# EAGLE design USB PROGRAMMER (EAGLE 8.3.1)
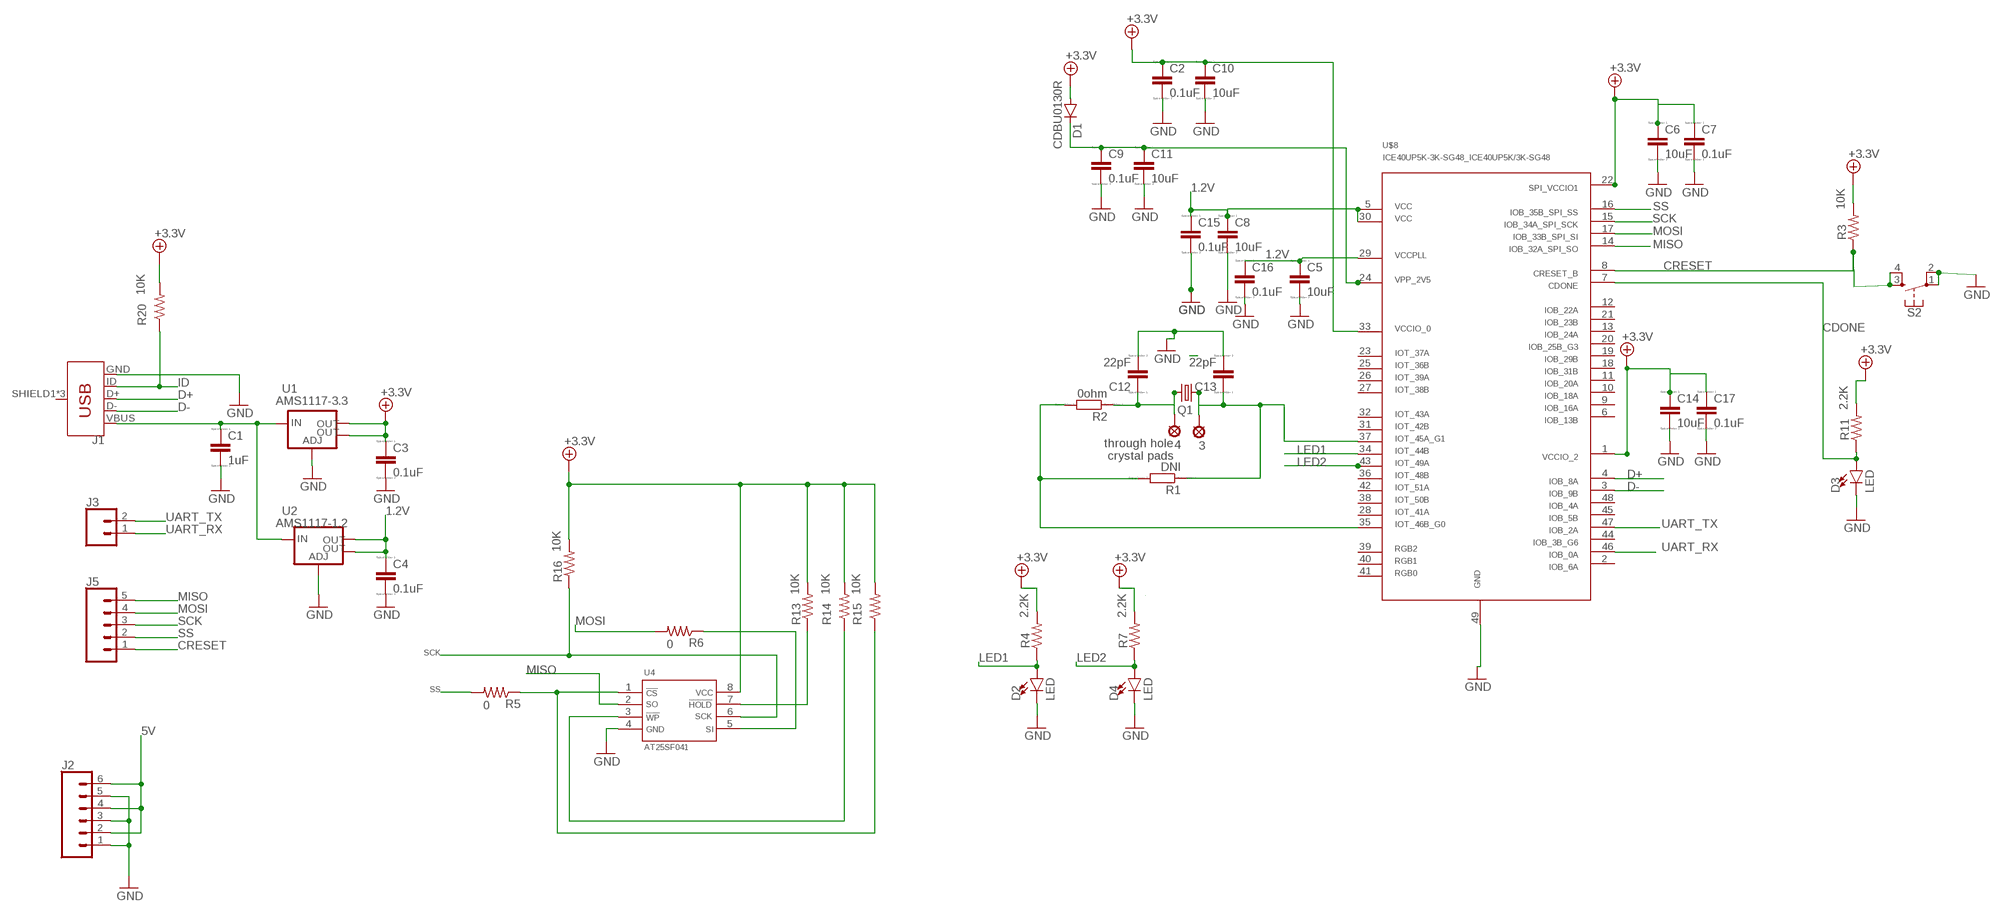
[diagram p0: schematic, sheet 1]

## Parts
3  LSP10  [LSP10]
4  LSP10  [LSP10]
C1  1uF  CC0402  [C0402]
C2  0.1uF  CC0402  [C0402]
C3  0.1uF  CC0402  [C0402]
C4  0.1uF  CC0402  [C0402]
C5  10uF  CC0402  [C0402]
C6  10uF  CC0402  [C0402]
C7  0.1uF  CC0402  [C0402]
C8  10uF  CC0402  [C0402]
C9  0.1uF  CC0402  [C0402]
C10  10uF  CC0402  [C0402]
C11  10uF  CC0402  [C0402]
C12  22pF  CC0402  [C0402]
C13  22pF  CC0402  [C0402]
C14  10uF  CC0402  [C0402]
C15  0.1uF  CC0402  [C0402]
C16  0.1uF  CC0402  [C0402]
C17  0.1uF  CC0402  [C0402]
D1  CDBU0130R  DIODE1  [SOD523]
D2  LED  LED0603  [LED-0603]
D3  LED  LED0603  [LED-0603]
D4  LED  LED0603  [LED-0603]
J1  USB_MICRO-B_FEMALE-SMT  [USB-B-MICRO-SMD]
J2  CONN_06NO_SILK_FEMALE_PTH  [1X06_NO_SILK]
J3  CONN_02  [1X02]
J5  CONN_05  [1X05]
Q1  CRYSTALHC49UP  [HC49UP]
R1  DNI  RR0402  [R0402]
R2  0ohm  RR0402  [R0402]
R3  10K  RESISTOR0603  [0603-RES]
R4  2.2K  RESISTOR0603  [0603-RES]
R5  0  RESISTOR0805-RES  [0805]
R6  0  RESISTOR0805-RES  [0805]
R7  2.2K  RESISTOR0603  [0603-RES]
R11  2.2K  RESISTOR0603  [0603-RES]
R13  10K  RESISTOR0603-RES  [0603-RES]
R14  10K  RESISTOR0603-RES  [0603-RES]
R15  10K  RESISTOR0603-RES  [0603-RES]
R16  10K  RESISTOR0603-RES  [0603-RES]
R20  10K  RESISTOR0603  [0603-RES]
S2  MOMENTARY-SWITCH-SPST-2-SMD-4.6X2.8MM  [TACTILE_SWITCH_SMD_4.6X2.8MM]
U1  AMS1117-3.3  V_REG_LM1117SOT223  [SOT223]
U2  AMS1117-1.2  V_REG_LM1117SOT223  [SOT223]
U4  AT25SF041  [SO8]
U$8  ICE40UP5K-3K-SG48_ICE40UP5K/3K-SG48  [ICE40UP5K-3K-SG48_ICE40UP5K/3K-SG48]

## Nets
1.2V: C4.1 C5.1 C8.1 C15.1 C16.1 U2.2(OUT) U2.4(OUT) U$8.5 U$8.29 U$8.30
2: R1.2 R2.2 U$8.35
5V: C1.1 J1.VBUS J2.2 J2.4 J2.6 U1.3(IN) U2.3(IN)
+3.3V: C2.1 C3.1 C6.1 C7.1 C10.1 C14.1 C17.1 D1.A R3.2 R4.2 R7.2 R11.2 R13.2 R14.2 R15.2 R16.2 R20.2 U1.2(OUT) U1.4(OUT) U4.8 U$8.1 U$8.22 U$8.33
CDONE: D3.A R11.1 U$8.7
CRESET: J5.1 R3.1 S2.3 S2.4 U$8.8
D+: J1.D+ U$8.4
D-: J1.D- U$8.3
GND: C1.2 C2.2 C3.2 C4.2 C5.2 C6.2 C7.2 C8.2 C9.2 C10.2 C11.2 C12.2 C13.2 C14.2 C15.2 C16.2 C17.2 D2.C D3.C D4.C J1.GND J2.1 J2.3 J2.5 S2.1 S2.2 U1.1(ADJ) U2.1(ADJ) U4.4 U$8.49
ID: J1.ID R20.1
LED1: D2.A R4.1 U$8.34
LED2: D4.A R7.1 U$8.43
MISO: J5.5 U4.2 U$8.14
MOSI: J5.4 R6.2 U$8.17
N$1: 4.MP C12.1 Q1.2 R2.1
N$4: R13.1 U4.7
N$5: 3.MP C13.1 Q1.1 R1.1 U$8.37
N$6: R14.1 U4.3
N$7: R5.1 R15.1 U4.1
N$10: C9.1 C11.1 D1.C U$8.24
N$13: R6.1 U4.5
N$15: U$8.39
N$16: U$8.40
SCK: J5.3 R16.1 U4.6 U$8.15
SS: J5.2 R5.2 U$8.16
UART_RX: J3.1 U$8.46
UART_TX: J3.2 U$8.47
Unconnected: J1.SHIELD1(SHIELD) J1.SHIELD2(SHIELD) J1.SHIELD3(SHIELD) U$8.2 U$8.6 U$8.9 U$8.10 U$8.11 U$8.12 U$8.13 U$8.18 U$8.19 U$8.20 U$8.21 U$8.23 U$8.25 U$8.26 U$8.27 U$8.28 U$8.31 U$8.32 U$8.36 U$8.38 U$8.41 U$8.42 U$8.44 U$8.45 U$8.48

## Notes on the sheet
- through hole
   crystal pads

## Library data of the parts
3 4 = solpad:LSP10: SOLDER PAD drill 1.0 mm, distributor Buerklin, 12H555
C1-C17 = eagle-ltspice:C: CAPACITOR, European symbol; SPICEMODEL: NONE; SPICEPREFIX: C
D1 = CDBU0130R:DIODE1
D2-D4 = SparkFun-LED:LED: LED (Generic) Standard schematic elements and footprints for 5mm, 3mm, 1206, and 0603 sized LEDs. Generic LEDs with no color specified.
J1 = MICRO USB 105164-0001:USB_MICRO-B: USB Type Micro-B Connector Male/female and PTH/SMT variants SparkFun Products: SparkFun microB USB Breakout <https://www.sparkfun.com/products/12035> SparkFun USB microB Plug Breakout <https://www.sparkfun.com/products/10031> SparkFun ESP8266 Thing <https://www.sparkfun.com/products/13231>; PROD_ID: CONN-11752
J2 = SparkFun-Connectors:CONN_06: Multi connection point. Often used as Generic Header-pin footprint for 0.1 inch spaced/style header connections On any of the 0.1 inch spaced packages, you can populate with these: Break Away Headers - Straight <https://www.sparkfun.com/products/116> (PRT-00116) Break Away Male Headers - Right Angle <https://www.sparkfun.com/products/553> (PRT-00553) Female Headers <https://www.sparkfun.com/products/115> (PRT-00115) Break Away Headers - Machine Pin <https://www.sparkfun.com/products/117> (PRT-00117) Break Away Female Headers - Swiss Machine Pin <https://www.sparkfun.com/products/743> (PRT-00743) Arduino Stackable Header - 6 Pin <https://www.sparkfun.com/products/9280> (PRT-09280) For SCREWTERMINALS and SPRING TERMINALS visit here: Screw Terimnals on SparkFun.com <https://www.sparkfun.com/search/results?term=Screw+Terminals> (5mm/3.5mm/2.54mm spacing) This device is also useful as a general connection point to wire up your design to another part of your project. Our various solder wires solder well into these plated through hole pads. Hook-Up Wire - Assortment (Stranded, 22 AWG) <https://www.sparkfun.com/products/11375> (PRT-11375) Hook-Up Wire - Assortment (Solid Core, 22 AWG) <https://www.sparkfun.com/products/11367> (PRT-11367) View the entire wire category on our website here <https://www.sparkfun.com/categories/141>; PROD_ID: CONN-08437
J3 = SparkFun-Connectors:CONN_02: Multi connection point. Often used as Generic Header-pin footprint for 0.1 inch spaced/style header connections On any of the 0.1 inch spaced packages, you can populate with these: Break Away Headers - Straight <https://www.sparkfun.com/products/116> (PRT-00116) Break Away Male Headers - Right Angle <https://www.sparkfun.com/products/553> (PRT-00553) Female Headers <https://www.sparkfun.com/products/115> (PRT-00115) Break Away Headers - Machine Pin <https://www.sparkfun.com/products/117> (PRT-00117) Break Away Female Headers - Swiss Machine Pin <https://www.sparkfun.com/products/743> (PRT-00743) For SCREWTERMINALS and SPRING TERMINALS visit here: Screw Terimnals on SparkFun.com <https://www.sparkfun.com/search/results?term=Screw+Terminals> (5mm/3.5mm/2.54mm spacing) This device is also useful as a general connection point to wire up your design to another part of your project. Our various solder wires solder well into these plated through hole pads. Hook-Up Wire - Assortment (Stranded, 22 AWG) <https://www.sparkfun.com/products/11375> (PRT-11375) Hook-Up Wire - Assortment (Solid Core, 22 AWG) <https://www.sparkfun.com/products/11367> (PRT-11367) View the entire wire category on our website here <https://www.sparkfun.com/categories/141> Special notes: Molex polarized connector foot print use with: PRT-08233 with associated crimp pins and housings. 2.54_SCREWTERM for use with PRT-10571. 3.5mm Screw Terminal footprints for PRT-08084 5mm Screw Terminal footprints for use with PRT-08432
J5 = SparkFun-Connectors:CONN_05: Multi connection point. Often used as Generic Header-pin footprint for 0.1 inch spaced/style header connections On any of the 0.1 inch spaced packages, you can populate with these: Break Away Headers - Straight <https://www.sparkfun.com/products/116> (PRT-00116) Break Away Male Headers - Right Angle <https://www.sparkfun.com/products/553> (PRT-00553) Female Headers <https://www.sparkfun.com/products/115> (PRT-00115) Break Away Headers - Machine Pin <https://www.sparkfun.com/products/117> (PRT-00117) Break Away Female Headers - Swiss Machine Pin <https://www.sparkfun.com/products/743> (PRT-00743) For SCREWTERMINALS and SPRING TERMINALS visit here: Screw Terimnals on SparkFun.com <https://www.sparkfun.com/search/results?term=Screw+Terminals> (5mm/3.5mm/2.54mm spacing) This device is also useful as a general connection point to wire up your design to another part of your project. Our various solder wires solder well into these plated through hole pads. Hook-Up Wire - Assortment (Stranded, 22 AWG) <https://www.sparkfun.com/products/11375> (PRT-11375) Hook-Up Wire - Assortment (Solid Core, 22 AWG) <https://www.sparkfun.com/products/11367> (PRT-11367) View the entire wire category on our website here <https://www.sparkfun.com/categories/141> Special notes: Molex polarized connector foot print use with SKU : PRT-08231 with associated crimp pins and housings. 1MM SMD Version SKU: PRT-10208
Q1 = crystal:CRYSTAL: CRYSTAL; OC_FARNELL: unknown; OC_NEWARK: unknown
R1 R2 = eagle-ltspice:R: RESISTOR, European symbol; SPICEMODEL: NONE; SPICEPREFIX: R
R3-R7 R11 R13-R16 R20 = SparkFun-Resistors:RESISTOR: Resistor Basic schematic elements and footprints for 0603, 1206, and PTH resistors.
S2 = SparkFun-Switches:MOMENTARY-SWITCH-SPST-2: Momentary Switch (Pushbutton) - SPST - Two Circuits Normally-open (NO) SPST momentary switches (buttons, pushbuttons). Schematic symbol includes two switch circuits. Variants SMD-4.6MMX2.8MM - 4.60mm x 2.80mm Tactile Momentary Button Switch - Used on SparkFun SAMD21 Mini Breakout <https://www.sparkfun.com/products/13664> SMD-5.2MM - Mini Pushbutton Switch - SMD <https://www.sparkfun.com/products/8720> - Used on Arduino Pro Mini <https://www.sparkfun.com/products/11114>; PROD_ID: SWCH-13065
U1 U2 = SparkFun-IC-Power:V_REG_LM1117: Voltage Regulator LM1117 Standard adjustable voltage regulator but in SMD form. Spark Fun Electronics SKU : COM-00595; PROD_ID: VREG-08170
U4 = AT25SF041:AT25SF041
U$8 = ICE40UP5K-3K-SG48:ICE40UP5K-3K-SG48_ICE40UP5K/3K-SG48

## Net classes
0 default: width 0.1 mm, drill 0.305 mm

## Board
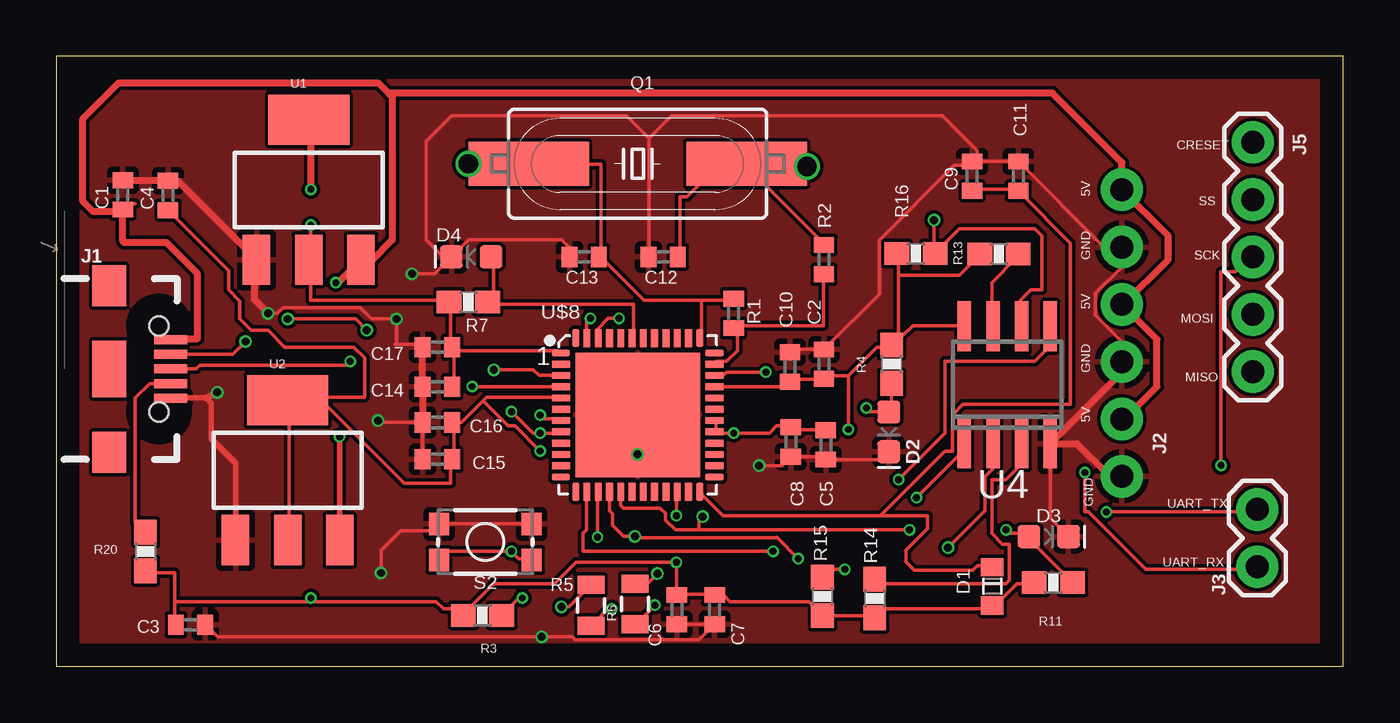
[diagram p1: board, top side]
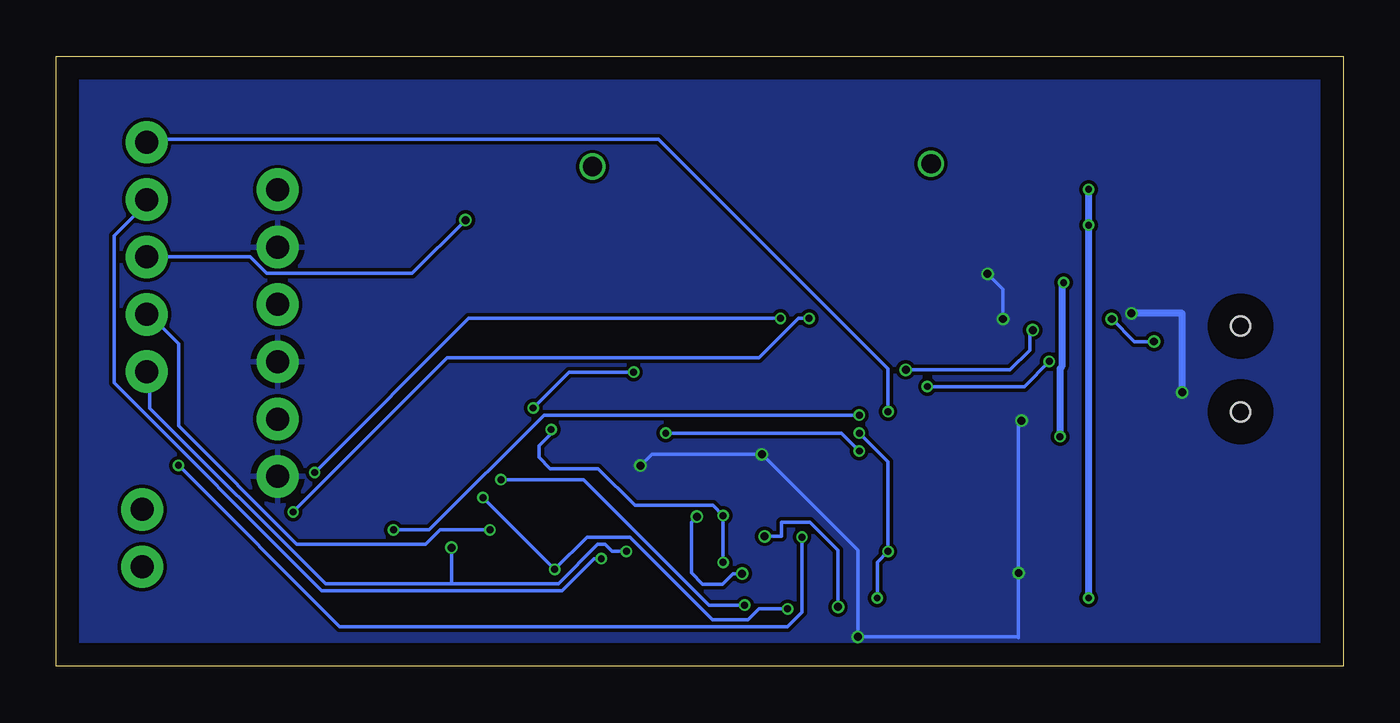
[diagram p2: board, bottom side, seen from below]

Size 57 x 27 mm. Coordinates in mm from the lower left corner, seen from the top.
Outline: 0,0 57,0 57,27 0,27 0,0
Copper layers (1*16): Top 0.035mm / dielectric 1.5mm / Bottom 0.035mm
Design rules "default *": minimum track width 6mil, minimum drill 0.3mm, track to track 6mil, track to pad 6mil, pad to pad 6mil, via to via 6mil, smd to smd 0mil, copper to edge 40mil, drill to drill 8mil, minimum pad ring 5mil, minimum via ring 4mil, stop-mask expansion 4mil, vias tented up to drill 0mil, thermal gap 10mil

### Footprints (pad centres in the part's own frame; a part is rotated, then mirrored left to right if it is on the bottom)
LSP10 = drill 0.85: MP 0,0
C0402 = smd 0.7 x 0.9: 1 -0.65,0; 2 0.65,0
SOD523 = smd 0.8 x 1: A 1.1,0; C -0.6,0
LED-0603 = smd 1 x 1: A -0.877,0; C 0.877,0
USB-B-MICRO-SMD = smd 1.45 x 0.4: D+ 2.725,0; D- 2.725,0.65; GND 2.725,-1.3; ID 2.725,-0.65; VBUS 2.725,1.3 | smd 1.5 x 1.8: SHIELD1 0,3.685; SHIELD2 0,-3.685 | smd 1.5 x 2.5: SHIELD3 0,0 | hole 0.85: 2.2,1.9; 2.2,-1.9
1X06_NO_SILK = drill 1.016 pad 1.88: 1 0,0; 2 2.54,0; 3 5.08,0; 4 7.62,0; 5 10.16,0; 6 12.7,0
1X02 = drill 1.016 pad 1.88: 1 0,0; 2 2.54,0
1X05 = drill 1.016 pad 1.88: 1 0,0; 2 2.54,0; 3 5.08,0; 4 7.62,0; 5 10.16,0
HC49UP = smd 5.334 x 1.93: 1 -4.826,0; 2 4.826,0
R0402 = smd 0.7 x 0.9: 1 -0.65,0; 2 0.65,0
0603-RES = smd 1.1 x 1: 1 -0.85,0; 2 0.85,0
0805 = smd 0.8 x 1.2: 1 -0.9,0; 2 0.9,0
TACTILE_SWITCH_SMD_4.6X2.8MM = smd 0.9 x 1: 1 -2.05,-0.8; 2 2.05,-0.8; 3 2.05,0.8; 4 -2.05,0.8
SOT223 = smd 1.219 x 2.235: 1 -2.311,-3.099; 2 0,-3.099; 3 2.311,-3.099 | smd 3.6 x 2.2: 4 0,3.099
SO8 = smd 0.6 x 2.2: 1 -1.905,-2.6; 2 -0.635,-2.6; 3 0.635,-2.6; 4 1.905,-2.6; 5 1.905,2.6; 6 0.635,2.6; 7 -0.635,2.6; 8 -1.905,2.6
ICE40UP5K-3K-SG48_ICE40UP5K/3K-SG48 = smd 0.8 x 0.3: 1 -3.4,2.75; 2 -3.4,2.25; 3 -3.4,1.75; 4 -3.4,1.25; 5 -3.4,0.75; 6 -3.4,0.25; 7 -3.4,-0.25; 8 -3.4,-0.75; 9 -3.4,-1.25; 10 -3.4,-1.75; 11 -3.4,-2.25; 12 -3.4,-2.75; 25 3.4,-2.75; 26 3.4,-2.25; 27 3.4,-1.75; 28 3.4,-1.25; 29 3.4,-0.75; 30 3.4,-0.25; 31 3.4,0.25; 32 3.4,0.75; 33 3.4,1.25; 34 3.4,1.75; 35 3.4,2.25; 36 3.4,2.75 | smd 0.3 x 0.8: 13 -2.75,-3.4; 14 -2.25,-3.4; 15 -1.75,-3.4; 16 -1.25,-3.4; 17 -0.75,-3.4; 18 -0.25,-3.4; 19 0.25,-3.4; 20 0.75,-3.4; 21 1.25,-3.4; 22 1.75,-3.4; 23 2.25,-3.4; 24 2.75,-3.4; 37 2.75,3.4; 38 2.25,3.4; 39 1.75,3.4; 40 1.25,3.4; 41 0.75,3.4; 42 0.25,3.4; 43 -0.25,3.4; 44 -0.75,3.4; 45 -1.25,3.4; 46 -1.75,3.4; 47 -2.25,3.4; 48 -2.75,3.4 | smd 5.5 x 5.5: 49 0,0

### Placement (x,y rotation side)
3  18.25,22.25 0 top
4  33.25,22.12 0 top
C1  2.94,20.87 90 top
C2  34,13.38 90 top
C3  5.95,1.83 0 top
C4  4.95,20.84 90 top
C5  34.09,9.8 270 top
C6  27.48,2.5 270 top
C7  29.16,2.5 270 top
C8  32.53,9.93 270 top
C9  40.56,21.7 90 top
C10  32.5,13.25 90 top
C11  42.62,21.7 90 top
C12  26.88,18.12 180 top
C13  23.38,18.12 180 top
C14  16.88,12.38 180 top
C15  16.88,9.16 180 top
C16  16.88,10.79 180 top
C17  16.88,14.12 180 top
D1  41.46,3.79 270 top
D2  36.88,10.38 270 top
D3  43.96,5.74 0 top
D4  18.38,18.12 180 top
J1  2.34,13.16 0 top
J2  47.2,8.4 90 top
J3  53.2,4.4 90 top
J5  53,23.2 270 top
Q1  25.75,22.25 0 top
R1  30,15.62 270 top
R2  34,18 270 top
R3  18.88,2.25 180 top
R4  37,13.38 90 top
R5  23.68,2.69 90 top
R6  25.62,2.75 90 top
R7  18.25,16.12 180 top
R11  44.16,3.71 180 top
R13  41.76,18.25 180 top
R14  36.25,3 270 top
R15  33.94,3.09 270 top
R16  38.08,18.27 180 top
R20  3.95,5.08 270 top
S2  19,5.5 180 top
U1  11.18,21.09 0 top
U2  10.24,8.68 0 top
U4  42.12,12.46 0 top
U$8  25.75,11.12 0 top

### Tracks (layer width: path | path; a pad name or v marks a point on that pad's centre or on a via)
1.2V  (via drill 0.3)
  Top 0.152: U$8.30 29.21,10.79 29.21,10.48 U$8.29 29.21,10.32 v30,10.32 31.59,10.32 31.91,10.64 32.38,10.64 C8.1 32.54,10.48 33.97,10.48 C5.1 | 18.89,11.75 17.94,10.79 17.62,10.79 C16.1 17.62,10.64 17.62,9.21 C15.1 17.46,9.05 17.46,8.1 15.4,8.1 11.59,11.91 | 18.89,11.75 19.05,11.91 22.23,11.91 U$8.5 | v21.43,9.53 20.32,10.64 20,10.64 18.89,11.75 | 11.59,11.91 10.32,11.91 U2.4 | 11.59,11.91 13.65,11.91 13.65,13.65 13.18,14.13 10.12,14.13 9.38,14.88 8.62,14.88 8.12,15.38 8.12,16.16 7.62,16.67 7.62,17.52 C4.1 5.08,20.16 | U2.2 10.32,5.71 10.32,11.75 U2.4 | 11.59,11.91 U2.4
  Bottom 0.152: v30,10.32 22.23,10.32 v21.43,9.53
2
  Top 0.152: U$8.35 29.21,13.49 29.69,13.49 30.16,13.97 30.16,14.92 30,14.92 R1.2 30,15.08 33.97,15.08 33.97,17.3 R2.2
5V  (via drill 0.3)
  Top 0.152: 3.49,20.48 3.17,20.48 3.02,20.32 C1.1 | v12.38,16.99 13.34,17.94 U1.3
  Top 0.254: U2.3 12.54,5.59 v12.54,10.16
  Top 0.305: J1.VBUS 5.11,14.5 6.25,14.5 6.25,17.38 4.88,18.75 3,18.75 2.94,18.81 C1.1 2.85,20.12 1.62,20.12 1.17,20.58 1.17,24.25 2.75,25.83 14.25,25.83 14.76,25.32 | 14.76,25.32 14.88,25.21 14.88,18.88 13.94,17.94 13.34,17.94 | U1.3 12.48,16.99 v12.38,16.99 | 14.76,25.32 14.81,25.38 44.12,25.38 47.2,22.3 J2.6 49.25,19.05 49.25,18 47.27,16.02 J2.4 48.75,14.47 48.75,12.38 47.31,10.94 J2.2
  Bottom 0.305: v12.54,10.16 12.54,13.18 12.46,13.26 12.46,16.91 v12.38,16.99
+3.3V  (via drill 0.3)
  Top 0.152: 17.62,13.97 22.23,13.97 U$8.1 | 17.62,13.97 17.62,12.38 C14.1 | 17.62,13.97 C17.1 17.46,14.13 17.46,16.03 R7.2 17.3,16.19 11.27,16.19 11.27,17.94 U1.2 11.27,18.1 v11.27,19.53 | U$8.33 29.21,12.38 32.23,12.38 32.38,12.54 C10.1 32.54,12.7 33.97,12.7 C2.1 34.13,12.86 35.08,12.86 | 37.47,14.61 37.94,15.08 40.16,15.08 U4.8 | 37.47,14.61 37.15,14.29 R4.2 | 37.31,17.3 37.31,14.61 37.47,14.61 | 37.31,17.3 37.31,18.26 R16.2 | 37.47,14.61 R4.2 | 37.31,17.3 40.01,17.3 40.8,18.1 R13.2 | 35.08,12.86 36.35,14.13 36.99,14.13 R4.2 | R11.2 43.18,3.65 42.55,3.65 41.59,2.7 D1.A 41.43,2.54 36.67,2.54 36.35,2.22 R14.2 36.2,2.22 33.97,2.22 R15.2 33.81,2.38 33.34,2.86 29.84,2.86 29.53,3.17 29.21,3.17 C7.1 29.05,3.17 27.62,3.17 C6.1 27.46,3.17 v27.46,4.59 26.83,4.6 23.02,4.6 22.07,3.65 19.37,3.65 18.26,2.54 | 5.24,2.86 5.24,4.13 3.97,4.13 R20.2 | 5.24,2.86 5.24,1.91 C3.1 | v27.46,6.67 27.46,7.62 U$8.22 | 18.26,2.54 18.1,2.38 R3.2 18.26,2.54 | 11.27,2.86 16.83,2.86 17.14,2.54 18.26,2.54 | 11.27,2.86 5.24,2.86 | v35.08,10.48 35.08,12.86 | 11.27,2.86 v11.27,3.02
  Top 0.305: U1.4 11.27,24.1 v11.27,21.11
  Bottom 0.152: v27.46,4.59 v27.46,6.67 27.92,7.12 31.38,7.12 33,8.75 35.12,8.75 35.62,9.25 35.62,9.75 35.08,10.29 v35.08,10.48 | v11.27,19.52 v11.27,19.53
  Bottom 0.305: v11.27,3.02 v11.27,19.52 | v11.27,19.53 v11.27,21.11
CDONE  (via drill 0.3)
  Top 0.152: v21.43,11.11 21.59,10.95 22.23,10.95 U$8.7 | v42.07,6.03 42.23,5.87 43.02,5.87 D3.A 43.02,5.71 44.93,3.81 R11.1
  Bottom 0.152: v21.43,11.11 35.4,11.11 40.48,6.03 v42.07,6.03
CRESET  (via drill 0.3)
  Top 0.152: U$8.8 22.23,10.32 v21.43,10.32 21.11,10.32 v20.16,11.27 | S2.4 20.95,4.76 20.48,4.76 v20.16,5.08 17.3,5.08 16.99,4.76 S2.3 | v20.64,3.02 20.48,3.02 19.84,2.38 R3.1
  Bottom 0.152: v21.43,10.32 20.16,9.05 v20.16,5.08 20.64,4.6 v20.64,3.02 | v20.16,11.27 20.16,13.18 30.32,23.34 52.86,23.34 J5.1
D+  (via drill 0.3)
  Top 0.152: v18.41,12.38 22.23,12.38 U$8.4 | v13.02,13.49 12.86,13.34 6.35,13.34 6.19,13.18 5.08,13.18 J1.D+
  Bottom 0.152: v13.02,13.49 14.13,12.38 v18.41,12.38
D-  (via drill 0.35)
  Top 0.152: U$8.3 21.38,12.88 21.12,13.12 v19.38,13.12 | v13.75,14.88 13.25,15.38 v10.25,15.38 | J1.D- 7.81,13.81 v8.38,14.38
  Bottom 0.152: v19.38,13.12 14.75,13.12 13.88,14 13.88,14.88 v13.75,14.88 | v10.25,15.38 9.25,14.38 v8.38,14.38
GND  (via drill 0.35)
  Top 0.152: S2.1 S2.2 16.65,6 15.25,6 14.38,5.12 v14.38,4.12 | C6.2 C7.2 28.48,1.17 22.98,1.17 22.85,1.29 v21.5,1.29 7.13,1.29 C3.2 | 47.2,13.33 J2.3 47.2,14.37 46.03,15.54 46.03,16.5 47.2,17.67 J2.5 46.41,18.56 C11.2 40.78,22.35 | D3.C 44.03,6.54 U4.4 | D2.C 36.53,9.15 C5.2 33.96,9.28 C8.2 32.13,8.88 v31.12,8.88 | C10.2 32.62,14.03 C2.2 36.45,16.48 36.45,18.87 39.76,22.17 40.39,22.17 C9.2 40.78,22.35 | v25.75,9.38 U$8.49 | 7.93,6.07 U2.1 | C15.2 16.23,11.09 | v9.38,15.63 9.79,15.63 10.04,15.88 13.46,15.88 13.96,15.38 v15.06,15.38 15.06,14.31 15,14.25 16.1,14.25 C17.2 | v14.25,10.88 14.25,10.75 14.29,10.79 C16.2 16.23,12.21 C14.2 16.23,12.4 | 17.54,18.16 D4.C 16.75,17.38 v15.75,17.38 | 17.54,18.16 18.25,18.88 22.38,18.88 22.73,18.52 C13.2 | C12.2 26.25,18.15 26.25,23.38 | 26.25,23.38 27.25,24.38 39.25,24.38 40.78,22.85 40.78,22.35 | 26.25,23.38 25.25,24.38 17.5,24.38 16.38,23.25 16.38,18.88 17.09,18.16 17.54,18.16
  Top 0.254: J1.GND 5.08,11.88 6.62,11.88 6.86,11.64 6.86,10.07 7.93,8.99 7.93,6.07
  Top 0.305: 16.23,11.09 16.23,12.21 16.23,12.4 C17.2 | C1.2 2.96,21.5 4.85,21.5 C4.2 5.37,21.5 8.78,18.09 | 8.78,18.09 U1.1 | 6.62,11.88 v7.12,12.12 | v9.38,15.63 8.78,16.23 8.78,18.09 | J2.1 46.67,8.4 45.21,9.86 U4.4 47.2,13.03 47.2,13.33
  Bottom 0.152: v31.12,8.88 30.62,9.38 v25.75,9.38 21.5,5.12 v21.5,1.29 14.42,1.29 arc90 14.38,1.25 14.38,3.95 v14.38,4.12 14.38,10.75 v14.25,10.88 | v15.75,17.38 15.06,16.69 v15.06,15.38
  Bottom 0.305: v7.12,12.12 7.12,15.62 v9.38,15.62 v9.38,15.63
  pour Top (isolate 0.12): 0,27 57,27 57,0 0,0
  pour Bottom (isolate 0.12): 0,27 57,27 57,0 0,0
ID
  Top 0.152: J1.ID 4.12,12.5 3.5,11.88 3.5,6.38 arc90 R20.1
LED1  (via drill 0.3)
  Top 0.152: v31.43,13.02 29.69,13.02 29.53,12.86 29.21,12.86 U$8.34 | v35.88,11.43 36.04,11.27 36.83,11.27 D2.A 36.99,11.27 36.99,12.38 R4.1
  Bottom 0.152: v31.43,13.02 34.29,13.02 v35.88,11.43
LED2
  Top 0.152: U$8.43 25.56,14.61 25.56,16.03 19.21,16.03 R7.1 19.21,16.19 19.37,16.19 19.37,18.1 D4.A
MISO  (via drill 0.3, 0.35)
  Top 0.152: v31.75,5.08 23.34,5.08 23.34,5.87 23.5,6.03 23.5,7.62 U$8.14 | v39.5,5.25 41.13,6.88 41.13,8.38 41.49,8.74 U4.2
  Bottom 0.152: v31.75,5.08 32.38,5.08 32.7,5.4 33.02,5.4 34.77,3.65 39.51,3.65 | 39.51,3.65 45.09,3.65 52.86,11.43 52.86,13.02 J5.5 | v39.5,5.25 39.5,3.66 39.51,3.65
MOSI  (via drill 0.3, 0.35)
  Top 0.152: 25.08,7.62 U$8.17 25,7.12 25.12,7 26.75,7 26.98,6.77 26.98,6.47 27.42,6.03 28.47,6.03 | 28.47,6.03 v37.79,6.03 | R6.2 26.18,3.65 v26.62,4.1 | v28.62,6.62 28.47,6.46 28.47,6.03
  Bottom 0.152: v37.79,6.03 40.01,6.03 40.64,5.4 46.35,5.4 51.59,10.64 51.59,14.29 52.86,15.56 J5.4 | v26.62,4.1 27.03,4.1 27.5,3.62 28.38,3.62 28.88,4.12 28.88,6.38 v28.62,6.62
N$1
  Top 0.152: 30.48,22.23 29.37,22.23 27.94,20.8 27.62,20.8 27.62,18.26 C12.1 | 30.48,22.23 33.97,18.73 R2.1 | 30.48,22.23 Q1.2 30.64,22.23 4.MP
N$4
  Top 0.152: R13.1 42.55,18.1 41.43,16.99 41.43,15.08 U4.7
N$5
  Top 0.152: 28.57,16.19 28.57,14.61 U$8.37 | 28.57,16.19 29.84,16.19 R1.1 | 28.57,16.19 26.04,16.19 24.13,18.1 C13.1 24.13,18.26 24.13,22.23 21.11,22.23 3.MP 20.95,22.23 Q1.1
N$6
  Top 0.152: R14.1 36.35,3.81 36.51,3.65 42.07,3.65 42.23,3.81 42.23,5.4 41.91,5.4 41.43,5.87 41.43,8.26 42.07,8.26 42.7,8.89 42.7,9.84 U4.3
N$7  (via drill 0.3)
  Top 0.152: v34.92,4.29 34.29,4.29 33.97,3.97 R15.1 | v38.1,7.46 40.16,9.53 40.16,9.84 U4.1 | v24.61,2.54 24.45,2.54 23.81,1.91 R5.1
  Bottom 0.152: v38.1,7.46 v34.92,4.29 33.5,5.71 31.59,5.71 27.94,2.06 26.35,2.06 25.88,2.54 v24.61,2.54
N$10
  Top 0.152: C9.1 40.64,21.11 42.55,21.11 C11.1 42.7,20.95 44.93,18.73 44.93,11.59 40.16,11.59 39.69,11.11 39.69,9.53 39.37,9.53 36.51,6.67 | 36.51,6.67 38.58,6.67 38.58,6.08 37.62,5.12 37.62,4.62 38,4.25 40.6,4.25 40.8,4.45 41.43,4.45 D1.C | 36.51,6.67 29.53,6.67 28.57,7.62 U$8.24
N$13  (via drill 0.3)
  Top 0.152: v26.51,2.7 25.72,1.91 R6.1 | v37.31,8.26 39.37,10.32 39.37,13.49 43.34,13.49 43.97,14.13 43.97,14.92 U4.5
  Bottom 0.152: v26.51,2.7 28.1,2.7 33.66,8.26 v37.31,8.26
SCK  (via drill 0.3, 0.35)
  Top 0.152: v23.97,5.71 23.97,7.62 U$8.15 | v51.59,8.89 51.59,17.46 52.23,17.46 52.86,18.1 J5.3 | U4.6 42.7,15.08 42.7,16.19 43.18,16.67 43.66,16.67 43.66,19.05 43.34,19.37 40.01,19.37 39.05,18.41 R16.1 38.88,18.33 v38.88,19.75
  Bottom 0.152: v23.97,5.71 23.97,2.38 24.61,1.75 44.45,1.75 v51.59,8.89 | J5.3 48.41,18.12 47.68,17.39 41.23,17.39 v38.88,19.75
SS  (via drill 0.3, 0.35)
  Top 0.152: v32.86,4.76 31.94,5.69 | 31.94,5.69 31.91,5.71 | 24.57,7.66 24.61,7.62 | 24.57,7.66 U$8.16 | R5.2 22.7,2.62 v22.38,2.62 | 24.57,7.66 24.5,7.58 24.5,6.88 24.62,6.75 24.62,6.25 25.12,5.75 v25.62,5.75 25.69,5.69 31.94,5.69
  Bottom 0.152: v32.86,4.76 33.18,4.76 34.61,3.33 45.24,3.33 54.45,12.54 54.45,19.05 52.86,20.64 J5.2 | v22.38,2.62 22.38,5.12 23.62,6.38 24.88,6.38 24.88,5.75 v25.62,5.75
UART_RX  (via drill 0.3)
  Top 0.152: v24.92,15.4 24.45,15.4 23.97,14.92 23.97,14.61 U$8.46 | v45.56,8.57 45.56,6.83 45.72,6.83 48.26,4.29 53.18,4.29 J3.1
  Bottom 0.152: v24.92,15.4 38.73,15.4 v45.56,8.57
UART_TX  (via drill 0.3)
  Top 0.152: v23.65,15.4 23.5,15.4 23.5,14.61 U$8.47 | v46.51,6.83 53.18,6.83 J3.2
  Bottom 0.152: v23.65,15.4 24.13,15.4 25.88,13.65 39.69,13.65 v46.51,6.83

### Text on the board
tPlace: CRESET | 5V | SS | GND | SCK | 5V | MOSI | GND | MISO | 5V | GND | UART_TX | UART_RX